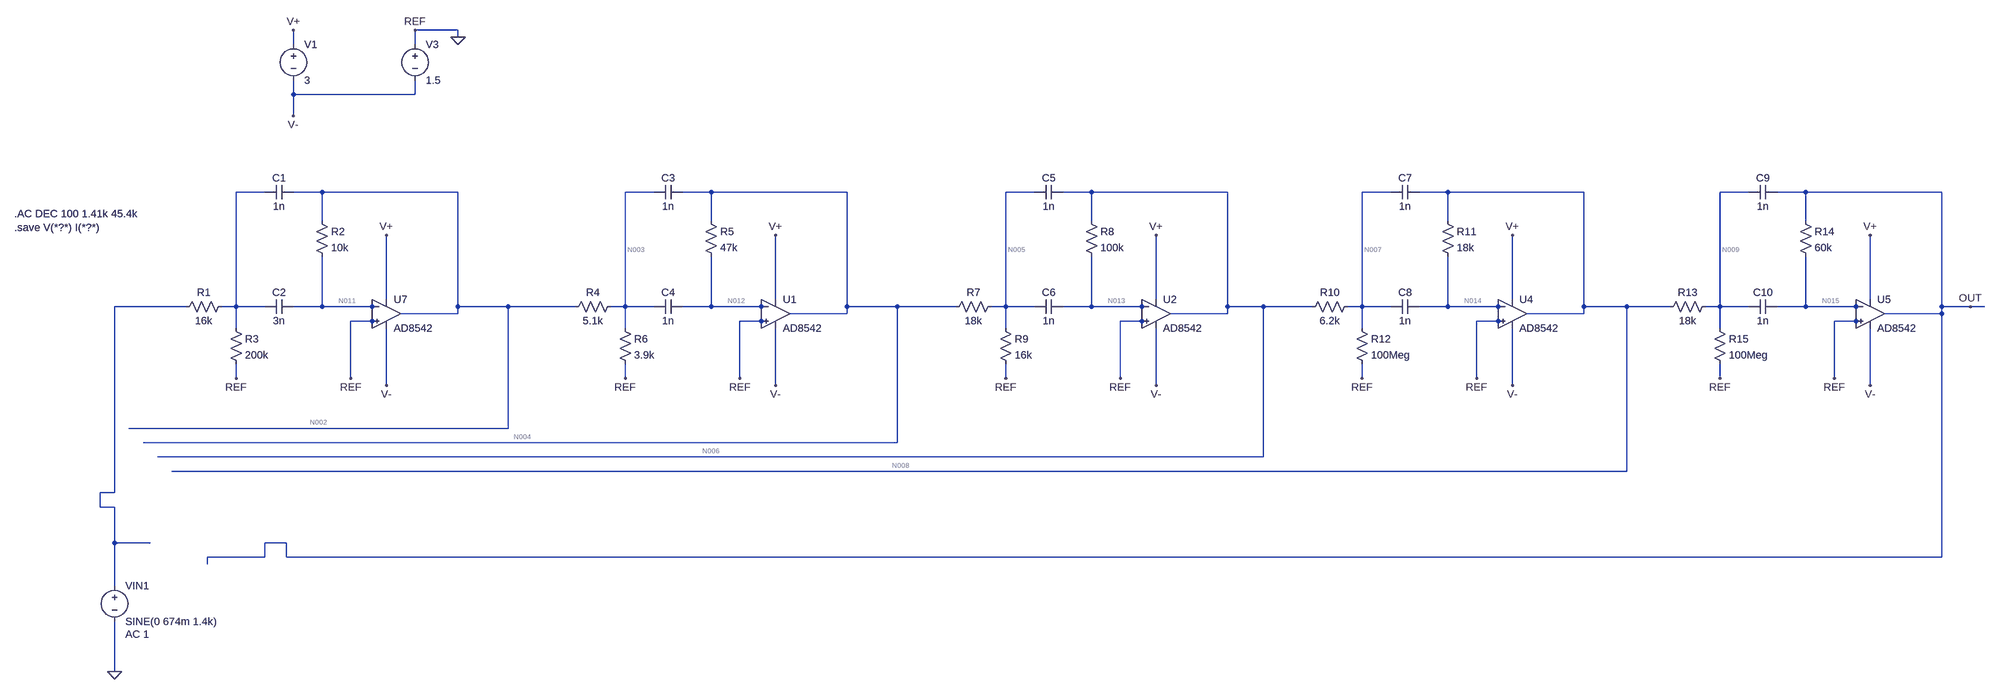
[diagram p0: schematic filter.asc]
filter.asc, the LTspice schematic file:
Version 4.1
SHEET 1 3052 724
WIRE -400 -752 -496 -752
WIRE -400 -736 -400 -752
WIRE -768 -720 -768 -752
WIRE -496 -720 -496 -752
WIRE -768 -608 -768 -640
WIRE -496 -608 -496 -640
WIRE -496 -608 -768 -608
WIRE -768 -560 -768 -608
WIRE -832 -368 -896 -368
WIRE -704 -368 -768 -368
WIRE -400 -368 -704 -368
WIRE 48 -368 -16 -368
WIRE 176 -368 112 -368
WIRE 480 -368 176 -368
WIRE 912 -368 848 -368
WIRE 1040 -368 976 -368
WIRE 1344 -368 1040 -368
WIRE 1712 -368 1648 -368
WIRE 1840 -368 1776 -368
WIRE 2144 -368 1840 -368
WIRE 2512 -368 2448 -368
WIRE 2640 -368 2576 -368
WIRE 2944 -368 2640 -368
WIRE -704 -304 -704 -368
WIRE 176 -304 176 -368
WIRE 1040 -304 1040 -368
WIRE 1840 -304 1840 -368
WIRE 2640 -304 2640 -368
WIRE -560 -128 -560 -272
WIRE 320 -128 320 -272
WIRE 1184 -128 1184 -272
WIRE 1984 -128 1984 -272
WIRE 2784 -128 2784 -272
WIRE -1008 -112 -1168 -112
WIRE -896 -112 -896 -368
WIRE -896 -112 -928 -112
WIRE -832 -112 -896 -112
WIRE -704 -112 -704 -224
WIRE -704 -112 -768 -112
WIRE -592 -112 -592 -128
WIRE -592 -112 -704 -112
WIRE -576 -112 -592 -112
WIRE -400 -112 -400 -368
WIRE -288 -112 -400 -112
WIRE -128 -112 -288 -112
WIRE -16 -112 -16 -368
WIRE -16 -112 -48 -112
WIRE 48 -112 -16 -112
WIRE 176 -112 176 -224
WIRE 176 -112 112 -112
WIRE 288 -112 288 -128
WIRE 288 -112 176 -112
WIRE 304 -112 288 -112
WIRE 480 -112 480 -368
WIRE 592 -112 480 -112
WIRE 736 -112 592 -112
WIRE 848 -112 848 -368
WIRE 848 -112 816 -112
WIRE 912 -112 848 -112
WIRE 1040 -112 1040 -224
WIRE 1040 -112 976 -112
WIRE 1152 -112 1152 -128
WIRE 1152 -112 1040 -112
WIRE 1168 -112 1152 -112
WIRE 1344 -112 1344 -368
WIRE 1424 -112 1344 -112
WIRE 1536 -112 1424 -112
WIRE 1648 -112 1648 -368
WIRE 1648 -112 1616 -112
WIRE 1712 -112 1648 -112
WIRE 1840 -112 1840 -224
WIRE 1840 -112 1776 -112
WIRE 1952 -112 1952 -128
WIRE 1952 -112 1840 -112
WIRE 1968 -112 1952 -112
WIRE 2144 -112 2144 -368
WIRE 2240 -112 2144 -112
WIRE 2336 -112 2240 -112
WIRE 2448 -112 2448 -368
WIRE 2448 -112 2416 -112
WIRE 2512 -112 2448 -112
WIRE 2640 -112 2640 -224
WIRE 2640 -112 2576 -112
WIRE 2752 -112 2752 -128
WIRE 2752 -112 2640 -112
WIRE 2768 -112 2752 -112
WIRE 2944 -112 2944 -368
WIRE 3008 -112 2944 -112
WIRE 3040 -112 3008 -112
WIRE -400 -96 -400 -112
WIRE -400 -96 -528 -96
WIRE 480 -96 480 -112
WIRE 480 -96 352 -96
WIRE 1344 -96 1344 -112
WIRE 1344 -96 1216 -96
WIRE 2144 -96 2144 -112
WIRE 2144 -96 2016 -96
WIRE 2944 -96 2944 -112
WIRE 2944 -96 2816 -96
WIRE -592 -80 -640 -80
WIRE 288 -80 240 -80
WIRE 1152 -80 1104 -80
WIRE 1168 -80 1152 -80
WIRE 1952 -80 1904 -80
WIRE 1968 -80 1952 -80
WIRE 2752 -80 2704 -80
WIRE 2768 -80 2752 -80
WIRE -896 -64 -896 -112
WIRE -592 -64 -592 -80
WIRE -16 -64 -16 -112
WIRE 288 -64 288 -80
WIRE 848 -64 848 -112
WIRE 1152 -64 1152 -80
WIRE 1648 -64 1648 -112
WIRE 1952 -64 1952 -80
WIRE 2448 -64 2448 -112
WIRE 2752 -64 2752 -80
WIRE -896 48 -896 16
WIRE -640 48 -640 -80
WIRE -16 48 -16 16
WIRE 240 48 240 -80
WIRE 848 48 848 16
WIRE 1104 48 1104 -80
WIRE 1648 48 1648 16
WIRE 1904 48 1904 -80
WIRE 2448 48 2448 16
WIRE 2704 48 2704 -80
WIRE -560 64 -560 -64
WIRE 320 64 320 -64
WIRE 1184 64 1184 -64
WIRE 1984 64 1984 -64
WIRE 2784 64 2784 -64
WIRE -288 160 -288 -112
WIRE -288 160 -1136 160
WIRE 592 192 592 -112
WIRE 592 192 -1104 192
WIRE 1424 224 1424 -112
WIRE 1424 224 -1072 224
WIRE 2240 256 2240 -112
WIRE 2240 256 -1040 256
WIRE -1168 304 -1168 -112
WIRE -1168 304 -1200 304
WIRE -1200 336 -1200 304
WIRE -1168 336 -1200 336
WIRE -1168 416 -1168 336
WIRE -1088 416 -1168 416
WIRE -784 416 -832 416
WIRE -832 448 -832 416
WIRE -832 448 -960 448
WIRE -784 448 -784 416
WIRE 2944 448 2944 -96
WIRE 2944 448 -784 448
WIRE -960 464 -960 448
WIRE -1168 512 -1168 416
WIRE -1168 704 -1168 592
FLAG -560 -272 V+
FLAG -560 64 V-
FLAG -640 48 REF
FLAG -896 48 REF
FLAG 320 -272 V+
FLAG 320 64 V-
FLAG 240 48 REF
FLAG -16 48 REF
FLAG 1184 -272 V+
FLAG 1184 64 V-
FLAG 1104 48 REF
FLAG 848 48 REF
FLAG 1984 -272 V+
FLAG 1984 64 V-
FLAG 1904 48 REF
FLAG 1648 48 REF
FLAG 2784 -272 V+
FLAG 2784 64 V-
FLAG 3008 -112 OUT
FLAG 2704 48 REF
FLAG 2448 48 REF
FLAG -400 -736 0
FLAG -496 -752 REF
FLAG -1168 704 0
FLAG -768 -752 V+
FLAG -768 -560 V-
SYMBOL res -912 -128 R90
WINDOW 0 0 56 VBottom 2
WINDOW 3 32 56 VTop 2
SYMATTR InstName R1
SYMATTR Value 16k
SYMBOL cap -768 -384 R90
WINDOW 0 0 32 VBottom 2
WINDOW 3 32 32 VTop 2
SYMATTR InstName C1
SYMATTR Value 1n
SYMBOL res -720 -320 R0
SYMATTR InstName R2
SYMATTR Value 10k
SYMBOL cap -768 -128 R90
WINDOW 0 0 32 VBottom 2
WINDOW 3 32 32 VTop 2
SYMATTR InstName C2
SYMATTR Value 3n
SYMBOL res -32 -128 R90
WINDOW 0 0 56 VBottom 2
WINDOW 3 32 56 VTop 2
SYMATTR InstName R4
SYMATTR Value 5.1k
SYMBOL cap 112 -384 R90
WINDOW 0 0 32 VBottom 2
WINDOW 3 32 32 VTop 2
SYMATTR InstName C3
SYMATTR Value 1n
SYMBOL res 160 -320 R0
SYMATTR InstName R5
SYMATTR Value 47k
SYMBOL cap 112 -128 R90
WINDOW 0 0 32 VBottom 2
WINDOW 3 32 32 VTop 2
SYMATTR InstName C4
SYMATTR Value 1n
SYMBOL res -32 -80 R0
SYMATTR InstName R6
SYMATTR Value 3.9k
SYMBOL res 832 -128 R90
WINDOW 0 0 56 VBottom 2
WINDOW 3 32 56 VTop 2
SYMATTR InstName R7
SYMATTR Value 18k
SYMBOL cap 976 -384 R90
WINDOW 0 0 32 VBottom 2
WINDOW 3 32 32 VTop 2
SYMATTR InstName C5
SYMATTR Value 1n
SYMBOL res 1024 -320 R0
SYMATTR InstName R8
SYMATTR Value 100k
SYMBOL cap 976 -128 R90
WINDOW 0 0 32 VBottom 2
WINDOW 3 32 32 VTop 2
SYMATTR InstName C6
SYMATTR Value 1n
SYMBOL res 832 -80 R0
SYMATTR InstName R9
SYMATTR Value 16k
SYMBOL res 1632 -128 R90
WINDOW 0 0 56 VBottom 2
WINDOW 3 32 56 VTop 2
SYMATTR InstName R10
SYMATTR Value 6.2k
SYMBOL cap 1776 -384 R90
WINDOW 0 0 32 VBottom 2
WINDOW 3 32 32 VTop 2
SYMATTR InstName C7
SYMATTR Value 1n
SYMBOL res 1824 -320 R0
SYMATTR InstName R11
SYMATTR Value 18k
SYMBOL cap 1776 -128 R90
WINDOW 0 0 32 VBottom 2
WINDOW 3 32 32 VTop 2
SYMATTR InstName C8
SYMATTR Value 1n
SYMBOL res 2432 -128 R90
WINDOW 0 0 56 VBottom 2
WINDOW 3 32 56 VTop 2
SYMATTR InstName R13
SYMATTR Value 18k
SYMBOL cap 2576 -384 R90
WINDOW 0 0 32 VBottom 2
WINDOW 3 32 32 VTop 2
SYMATTR InstName C9
SYMATTR Value 1n
SYMBOL res 2624 -320 R0
SYMATTR InstName R14
SYMATTR Value 60k
SYMBOL cap 2576 -128 R90
WINDOW 0 0 32 VBottom 2
WINDOW 3 32 32 VTop 2
SYMATTR InstName C10
SYMATTR Value 1n
SYMBOL voltage -768 -736 R0
WINDOW 123 0 0 Left 2
WINDOW 39 0 0 Left 2
SYMATTR InstName V1
SYMATTR Value 3
SYMBOL voltage -496 -736 R0
WINDOW 123 0 0 Left 2
WINDOW 39 0 0 Left 2
SYMATTR InstName V3
SYMATTR Value 1.5
SYMBOL voltage -1168 496 R0
WINDOW 123 24 124 Left 2
WINDOW 39 0 0 Left 2
SYMATTR Value2 AC 1
SYMATTR InstName VIN1
SYMATTR Value SINE(0 674m 1.4k)
SYMBOL OpAmps\\AD8542 -560 -160 R0
SYMATTR InstName U7
SYMBOL OpAmps\\AD8542 320 -160 R0
SYMATTR InstName U1
SYMBOL OpAmps\\AD8542 1184 -160 R0
SYMATTR InstName U2
SYMBOL OpAmps\\AD8542 1984 -160 R0
SYMATTR InstName U4
SYMBOL OpAmps\\AD8542 2784 -160 R0
SYMATTR InstName U5
SYMBOL res -912 -80 R0
SYMATTR InstName R3
SYMATTR Value 200k
SYMBOL res 1632 -80 R0
SYMATTR InstName R12
SYMATTR Value 100Meg
SYMBOL res 2432 -80 R0
SYMATTR InstName R15
SYMATTR Value 100Meg
TEXT -1392 -320 Left 2 !.AC DEC 100 1.41k 45.4k \n.save V(*?*) I(*?*)

The netlist it stands for:
* filter.asc
R1 N001 N010 16k
C1 N002 N001 1n
R2 N002 N011 10k
C2 N011 N001 3n
R4 N003 N002 5.1k
C3 N004 N003 1n
R5 N004 N012 47k
C4 N012 N003 1n
R6 N003 0 3.9k
R7 N005 N004 18k
C5 N006 N005 1n
R8 N006 N013 100k
C6 N013 N005 1n
R9 N005 0 16k
R10 N007 N006 6.2k
C7 N008 N007 1n
R11 N008 N014 18k
C8 N014 N007 1n
R13 N009 N008 18k
C9 OUT N009 1n
R14 OUT N015 60k
C10 N015 N009 1n
V1 V+ V- 3
V3 0 V- 1.5
VIN1 N010 0 SINE(0 674m 1.4k) AC 1
X§U7 0 N011 V+ V- N002 AD8542  ; pins In+ In- V+ V- OUT
X§U1 0 N012 V+ V- N004 AD8542  ; pins In+ In- V+ V- OUT
X§U2 0 N013 V+ V- N006 AD8542  ; pins In+ In- V+ V- OUT
X§U4 0 N014 V+ V- N008 AD8542  ; pins In+ In- V+ V- OUT
X§U5 0 N015 V+ V- OUT AD8542  ; pins In+ In- V+ V- OUT
R3 N001 0 200k
R12 N007 0 100Meg
R15 N009 0 100Meg
.AC DEC 100 1.41k 45.4k
.save V(*?*) I(*?*)
.lib AD8542.sub
.backanno
.end

* Results of the author's LTspice run, read from the files saved beside the schematic
* Operating Point, zero values left out:
*   V(n002) = -1.146 mV
*   V(n003) = -496.6 µV
*   V(n004) = -1.146 mV
*   V(n005) = -539.2 µV
*   V(n006) = -1.146 mV
*   V(n007) = -1.145 mV
*   V(n008) = -1.146 mV
*   V(n009) = -1.146 mV
*   V(n011) = -1.146 mV
*   V(n012) = -1.146 mV
*   V(n013) = -1.146 mV
*   V(n014) = -1.146 mV
*   V(n015) = -1.146 mV
*   V(out) = -1.146 mV
*   V(v+) = 1.5 V
*   V(v-) = -1.5 V
*   I(R10) = 11.45 pA
*   I(R11) = 4.479 pA
*   I(R12) = -11.45 pA
*   I(R13) = 11.46 pA
*   I(R14) = 4.479 pA
*   I(R15) = -11.46 pA
*   I(R2) = 4.479 pA
*   I(R4) = 127.3 nA
*   I(R5) = 4.479 pA
*   I(R6) = -127.3 nA
*   I(R7) = 33.7 nA
*   I(R8) = 4.479 pA
*   I(R9) = -33.7 nA
*   I(V1) = -212.4 µA
*   I(V3) = -160.9 nA
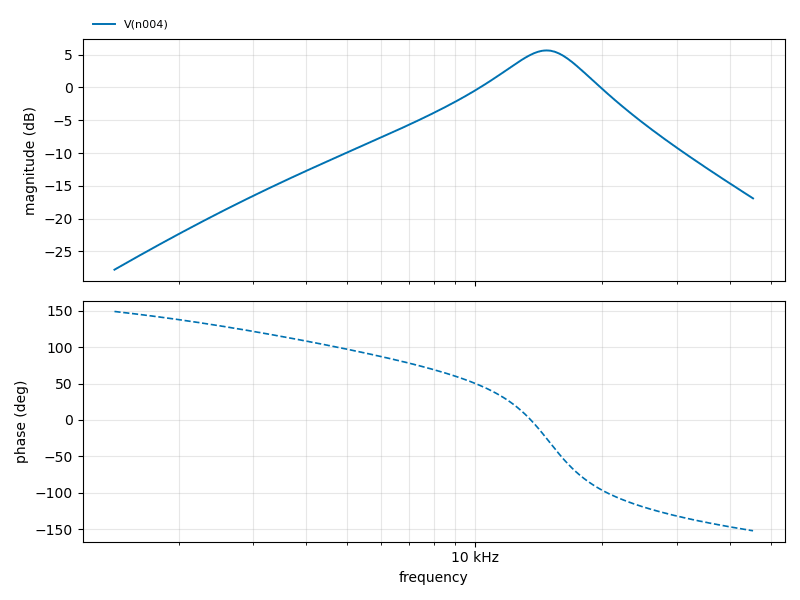
[diagram p1: AC Analysis of filter.asc, plotted from the saved traces]
* AC Analysis, 1 run:
*   V(n004): -27.80 dB at 1.41 kHz, -16.92 dB at 45.4 kHz, peak 5.66 dB at 14.76 kHz, 3 dB below the peak at 11.88 kHz and 17.87 kHz